# EAGLE design mLRS-rx-board01-v014 (EAGLE 7.5.0)
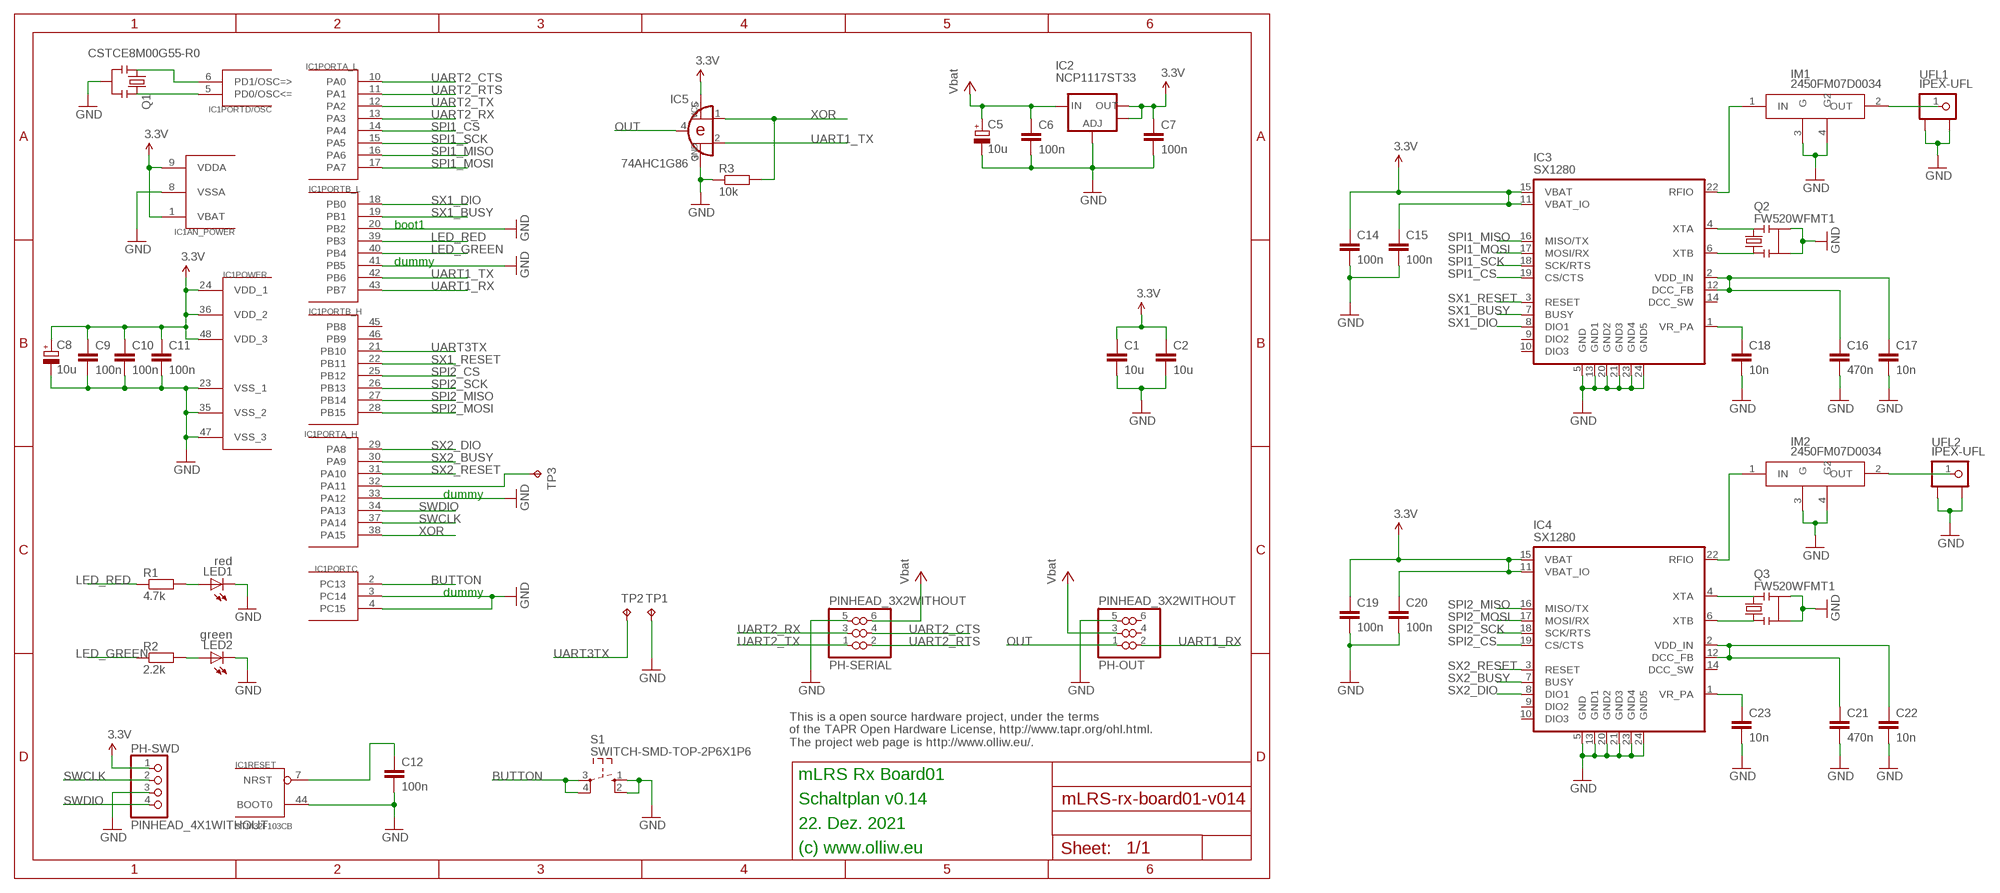
[diagram p0: schematic, sheet 1]

## Parts
C1  10u  C-EUC0603  [C0603]
C2  10u  C-EUC0603  [C0603]
C5  10u  CPOL-EUSMCA  [SMC_A]
C6  100n  C-EUC0603  [C0603]
C7  100n  C-EUC0603  [C0603]
C8  10u  CPOL-EUSMCA  [SMC_A]
C9  100n  C-EUC0603  [C0603]
C10  100n  C-EUC0603  [C0603]
C11  100n  C-EUC0603  [C0603]
C12  100n  C-EUC0603  [C0603]
C14  100n  C-EUC0402  [C0402]
C15  100n  C-EUC0402  [C0402]
C16  470n  C-EUC0402  [C0402]
C17  10n  C-EUC0402  [C0402]
C18  10n  C-EUC0402  [C0402]
C19  100n  C-EUC0402  [C0402]
C20  100n  C-EUC0402  [C0402]
C21  470n  C-EUC0402  [C0402]
C22  10n  C-EUC0402  [C0402]
C23  10n  C-EUC0402  [C0402]
IC1  STM32F103CB  STM32F10XCXT6  [TQFP48]
IC2  NCP1117ST33  V_REG_LM1117SOT223  [SOT223]
IC3  SX1280  [QFN24-4X4-SX128X]
IC4  SX1280  [QFN24-4X4-SX128X]
IC5  74AHC1G86  [SOT23-5-VER1]
IM1  2450FM07D0034  SX-IMPEDANCE-MATCH  [SX-IMPEDANCE-MATCH]
IM2  2450FM07D0034  SX-IMPEDANCE-MATCH  [SX-IMPEDANCE-MATCH]
LED1  red  LEDCHIPLED_0603  [CHIPLED_0603]
LED2  green  LEDCHIPLED_0603  [CHIPLED_0603]
PH-OUT  PINHEAD_3X2WITHOUT  [PINHEAD_3X2_WO]
PH-SERIAL  PINHEAD_3X2WITHOUT  [PINHEAD_3X2_WO]
PH-SWD  PINHEAD_4X1WITHOUT  [PINHEAD_4X1_WO]
Q1  CSTCE8M00G55-R0  RESONATORSMD  [RESONATOR-SMD]
Q2  FW520WFMT1  CRYSTAL52MHZ  [CRYSTAL-SMD-2X1P6-GND]
Q3  FW520WFMT1  CRYSTAL52MHZ  [CRYSTAL-SMD-2X1P6-GND]
R1  4.7k  R-EU_R0402  [R0402]
R2  2.2k  R-EU_R0402  [R0402]
R3  10k  R-EU_R0402  [R0402]
S1  SWITCH-SMD-TOP-2P6X1P6  [TACTILE-SWITCH-SMD-TOP-2P6X1X6]
TP1  TPB1,27  [B1,27]
TP2  TPB1,27  [B1,27]
TP3  TPTP08R  [TP08R]
UFL1  IPEX-UFL  [IPEX-UFL-SMD]
UFL2  IPEX-UFL  [IPEX-UFL-SMD]

## Nets
3.3V: C1.1 C2.1 C7.1 C8.+ C9.1 C10.1 C11.1 C14.1 C15.1 C19.1 C20.1 IC1.1(AN_POWER:VBAT) IC1.9(AN_POWER:VDDA) IC1.24(POWER:VDD_1) IC1.36(POWER:VDD_2) IC1.48(POWER:VDD_3) IC2.2(OUT) IC2.4(OUT) IC3.11(VBAT_IO) IC3.15(VBAT) IC4.11(VBAT_IO) IC4.15(VBAT) IC5.5(VCC) PH-SWD.1
BUTTON: IC1.2(PORTC:PC13) S1.3 S1.4
GND: C1.2 C2.2 C5.- C6.2 C7.2 C8.- C9.2 C10.2 C11.2 C12.2 C14.2 C15.2 C16.2 C17.2 C18.2 C19.2 C20.2 C21.2 C22.2 C23.2 IC1.3(PORTC:PC14) IC1.4(PORTC:PC15) IC1.8(AN_POWER:VSSA) IC1.20(PORTB_L:PB2) IC1.23(POWER:VSS_1) IC1.33(PORTA_H:PA12) IC1.35(POWER:VSS_2) IC1.41(PORTB_L:PB5) IC1.44(RESET:BOOT0) IC1.47(POWER:VSS_3) IC2.1(ADJ) IC3.5(GND) IC3.13(GND1) IC3.20(GND2) IC3.21(GND3) IC3.23(GND4) IC3.24(GND5) IC4.5(GND) IC4.13(GND1) IC4.20(GND2) IC4.21(GND3) IC4.23(GND4) IC4.24(GND5) IC5.3(GND) IM1.3(G) IM1.4(G2) IM2.3(G) IM2.4(G2) LED1.C LED2.C PH-OUT.5 PH-SERIAL.5 PH-SWD.3 Q1.2 Q2.2 Q2.4 Q3.2 Q3.4 R3.1 S1.1 S1.2 TP1.TP UFL1.2 UFL1.3 UFL2.2 UFL2.3
LED_GREEN: IC1.40(PORTB_L:PB4) R2.1
LED_RED: IC1.39(PORTB_L:PB3) R1.1
N$1: IC4.4(XTA) Q3.3
N$2: C21.1 C22.1 IC4.2(VDD_IN) IC4.12(DCC_FB)
N$3: C23.1 IC4.1(VR_PA)
N$4: IC4.6(XTB) Q3.1
N$5: C12.1 IC1.7(RESET:NRST)
N$6: IC4.22(RFIO) IM2.1(IN)
N$7: C16.1 C17.1 IC3.2(VDD_IN) IC3.12(DCC_FB)
N$9: IC1.32(PORTA_H:PA11) TP3.TP
N$10: C18.1 IC3.1(VR_PA)
N$11: IC3.4(XTA) Q2.3
N$12: IC1.5(PORTD/OSC:PD0/OSC<=) Q1.3
N$13: IC3.6(XTB) Q2.1
N$14: IC1.6(PORTD/OSC:PD1/OSC=>) Q1.1
N$15: IC3.22(RFIO) IM1.1(IN)
N$17: LED1.A R1.2
N$18: IM2.2(OUT) UFL2.1
N$19: LED2.A R2.2
OUT: IC5.4(O) PH-OUT.1
SPI1_CS: IC1.14(PORTA_L:PA4) IC3.19(CS/CTS)
SPI1_MISO: IC1.16(PORTA_L:PA6) IC3.16(MISO/TX)
SPI1_MOSI: IC1.17(PORTA_L:PA7) IC3.17(MOSI/RX)
SPI1_SCK: IC1.15(PORTA_L:PA5) IC3.18(SCK/RTS)
SPI2_CS: IC1.25(PORTB_H:PB12) IC4.19(CS/CTS)
SPI2_MISO: IC1.27(PORTB_H:PB14) IC4.16(MISO/TX)
SPI2_MOSI: IC1.28(PORTB_H:PB15) IC4.17(MOSI/RX)
SPI2_SCK: IC1.26(PORTB_H:PB13) IC4.18(SCK/RTS)
SWCLK: IC1.37(PORTA_H:PA14) PH-SWD.2
SWDIO: IC1.34(PORTA_H:PA13) PH-SWD.4
SX1_BUSY: IC1.19(PORTB_L:PB1) IC3.7(BUSY)
SX1_DIO: IC1.18(PORTB_L:PB0) IC3.8(DIO1)
SX1_RESET: IC1.22(PORTB_H:PB11) IC3.3(RESET)
SX2_BUSY: IC1.30(PORTA_H:PA9) IC4.7(BUSY)
SX2_DIO: IC1.29(PORTA_H:PA8) IC4.8(DIO1)
SX2_RESET: IC1.31(PORTA_H:PA10) IC4.3(RESET)
UART1_RX: IC1.43(PORTB_L:PB7) PH-OUT.2
UART1_TX: IC1.42(PORTB_L:PB6) IC5.2(I1)
UART2_CTS: IC1.10(PORTA_L:PA0) PH-SERIAL.4
UART2_RTS: IC1.11(PORTA_L:PA1) PH-SERIAL.2
UART2_RX: IC1.13(PORTA_L:PA3) PH-SERIAL.3
UART2_TX: IC1.12(PORTA_L:PA2) PH-SERIAL.1
UART3TX: IC1.21(PORTB_H:PB10) TP2.TP
UFL1: IM1.2(OUT) UFL1.1
VCC: C5.+ C6.1 IC2.3(IN) PH-OUT.3 PH-SERIAL.6 ; supply symbol labelled Vbat
XOR: IC1.38(PORTA_H:PA15) IC5.1(I0) R3.2
Unconnected: IC1.45(PORTB_H:PB8) IC1.46(PORTB_H:PB9) IC3.9(DIO2) IC3.10(DIO3) IC3.14(DCC_SW) IC4.9(DIO2) IC4.10(DIO3) IC4.14(DCC_SW) PH-OUT.4 PH-OUT.6

## Notes on the sheet
- boot1
- dummy
- dummy
- dummy
- This is a open source hardware project, under the terms
  of the TAPR Open Hardware License, http://www.tapr.org/ohl.html.
  The project web page is http://www.olliw.eu/.
- mLRS Rx Board01
- Schaltplan v0.14
- 22. Dez. 2021
- (c) www.olliw.eu

## Library data of the parts
C1 C2 C6 C7 C9-C12 C14-C23 = rcl:C-EU: CAPACITOR, European symbol
C5 C8 = rcl:CPOL-EU: POLARIZED CAPACITOR, European symbol
IC1 = # stm32:STM32F10XCXT6: ST STM32F101/103 48pin LQFP
IC2 = # SparkFun2:V_REG_LM1117: Voltage Regulator LM1117 Standard adjustable voltage regulator but in SMD form. Spark Fun Electronics SKU : COM-00595
IC3 IC4 = # stdlib:SX1280
IC5 = # stdlib:74AHC1G86
IM1 IM2 = # stdlib:SX-IMPEDANCE-MATCH
LED1 LED2 = led:LED: LED OSRAM: - CHIPLED LG R971, LG N971, LY N971, LG Q971, LY Q971, LO R971, LY R971 LH N974, LH R974 LS Q976, LO Q976, LY Q976 LO Q996 - Hyper CHIPLED LW Q18S LB Q993, LB Q99A, LB R99A - SideLED LS A670, LO A670, LY A670, LG A670, LP A670 LB A673, LV A673, LT A673, LW A673 LH A674 LY A675 LS A676, LA A676, LO A676, LY A676, LW A676 LS A679, LY A679, LG A679 - Hyper Micro SIDELED® LS Y876, LA Y876, LO Y876, LY Y876 LT Y87S - SmartLED LW L88C, LW L88S LB L89C, LB L89S, LG L890 LS L89K, LO L89K, LY L89K LS L896, LA L896, LO L896, LY L896 - TOPLED LS T670, LO T670, LY T670, LG T670, LP T670 LSG T670, LSP T670, LSY T670, LOP T670, LYG T670 LG T671, LOG T671, LSG T671 LB T673, LV T673, LT T673, LW T673 LH T674 LS T676, LA T676, LO T676, LY T676, LB T676, LH T676, LSB T676, LW T676 LB T67C, LV T67C, LT T67C, LS T67K, LO T67K, LY T67K, LW E67C LS E67B, LA E67B, LO E67B, LY E67B, LB E67C, LV E67C, LT E67C LW T67C LS T679, LY T679, LG T679 LS T770, LO T770, LY T770, LG T770, LP T770 LB T773, LV T773, LT T773, LW T773 LH T774 LS E675, LA E675, LY E675, LS T675 LS T776, LA T776, LO T776, LY T776, LB T776 LHGB T686 LT T68C, LB T68C - Hyper Mini TOPLED® LB M676 - Mini TOPLED Santana® LG M470 LS M47K, LO M47K, LY M47K Source: http://www.osram.convergy.de LUXEON: - LUMILED® LXK2-PW12-R00, LXK2-PW12-S00, LXK2-PW14-U00, LXK2-PW14-V00 LXK2-PM12-R00, LXK2-PM12-S00, LXK2-PM14-U00 LXK2-PE12-Q00, LXK2-PE12-R00, LXK2-PE12-S00, LXK2-PE14-T00, LXK2-PE14-U00 LXK2-PB12-K00, LXK2-PB12-L00, LXK2-PB12-M00, LXK2-PB14-N00, LXK2-PB14-P00, LXK2-PB14-Q00 LXK2-PR12-L00, LXK2-PR12-M00, LXK2-PR14-Q00, LXK2-PR14-R00 LXK2-PD12-Q00, LXK2-PD12-R00, LXK2-PD12-S00 LXK2-PH12-R00, LXK2-PH12-S00 LXK2-PL12-P00, LXK2-PL12-Q00, LXK2-PL12-R00 Source: www.luxeon.com KINGBRIGHT: KA-3528ASYC Source: www.kingbright.com
PH-OUT PH-SERIAL = # stdlib:PINHEAD_3X2
PH-SWD = # stdlib:PINHEAD_4X1
Q1 = # SparkFun2:RESONATOR: Resonator Small SMD resonator. This is the itty bitty 10/20MHz resonators with built in caps. CSTCE10M0G55 and CSTCE20M0V53. Footprint has been reviewed closely but hasn't been tested yet.
Q2 Q3 = # stdlib:CRYSTAL52MHZ
R1-R3 = rcl:R-EU_: RESISTOR, European symbol
S1 = # stdlib:SWITCH-SMD-TOP-2P6X1P6
TP1-TP3 = testpad:TP: Test pad
UFL1 UFL2 = # stdlib:IPEX-UFL

## Board
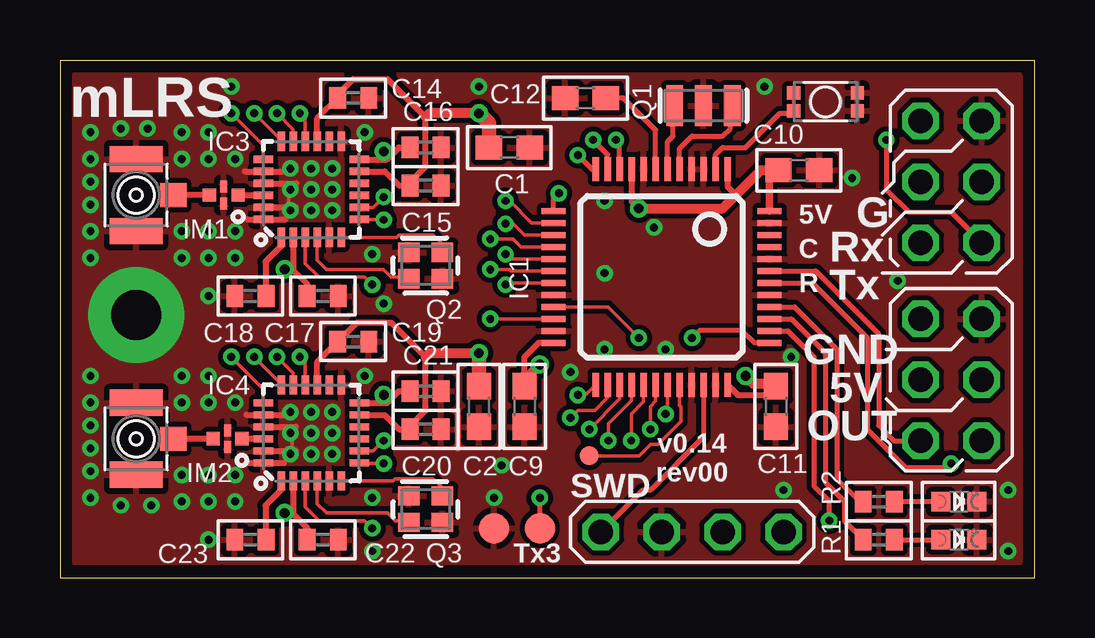
[diagram p1: board, top side]
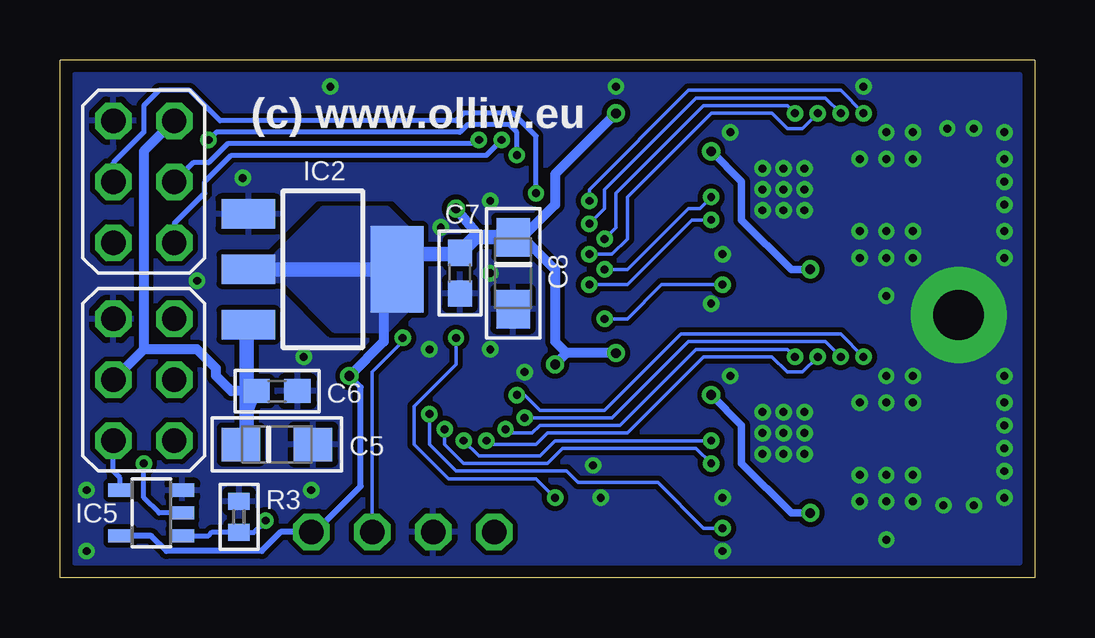
[diagram p2: board, bottom side, seen from below]

Size 40.64 x 21.59 mm. Coordinates in mm from the lower left corner, seen from the top.
Outline: 40.64,0 40.64,21.59 0,21.59 0,0 40.64,0
Copper layers (1*16): Top 0.0356mm / dielectric 1.5011mm / Bottom 0.0356mm
Design rules "ow-oshpark-2layer": minimum track width 6mil, minimum drill 13mil, track to track 6mil, track to pad 6mil, pad to pad 6mil, via to via 6mil, smd to smd 6mil, copper to edge 15mil, drill to drill 6mil, minimum pad ring 7mil, minimum via ring 7mil, stop-mask expansion 2.5mil, vias tented up to drill 26mil, thermal gap 10mil

### Footprints (pad centres in the part's own frame; a part is rotated, then mirrored left to right if it is on the bottom)
C0603 = smd 1.1 x 1: 1 -0.85,0; 2 0.85,0
SMC_A = smd 1.6 x 1.4: + -1.5,0; - 1.5,0
C0402 = smd 0.7 x 0.9: 1 -0.65,0; 2 0.65,0
TQFP48 = smd 0.254 x 1: 1 -2.75,-4.5; 2 -2.25,-4.5; 3 -1.75,-4.5; 4 -1.25,-4.5; 5 -0.75,-4.5; 6 -0.25,-4.5; 7 0.25,-4.5; 8 0.75,-4.5; 9 1.25,-4.5; 10 1.75,-4.5; 11 2.25,-4.5; 12 2.75,-4.5; 25 2.75,4.5; 26 2.25,4.5; 27 1.75,4.5; 28 1.25,4.5; 29 0.75,4.5; 30 0.25,4.5; 31 -0.25,4.5; 32 -0.75,4.5; 33 -1.25,4.5; 34 -1.75,4.5; 35 -2.25,4.5; 36 -2.75,4.5 | smd 1 x 0.254: 13 4.5,-2.75; 14 4.5,-2.25; 15 4.5,-1.75; 16 4.5,-1.25; 17 4.5,-0.75; 18 4.5,-0.25; 19 4.5,0.25; 20 4.5,0.75; 21 4.5,1.25; 22 4.5,1.75; 23 4.5,2.25; 24 4.5,2.75; 37 -4.5,2.75; 38 -4.5,2.25; 39 -4.5,1.75; 40 -4.5,1.25; 41 -4.5,0.75; 42 -4.5,0.25; 43 -4.5,-0.25; 44 -4.5,-0.75; 45 -4.5,-1.25; 46 -4.5,-1.75; 47 -4.5,-2.25; 48 -4.5,-2.75
SOT223 = smd 1.219 x 2.235: 1 -2.311,-3.099; 2 0,-3.099; 3 2.311,-3.099 | smd 3.6 x 2.2: 4 0,3.099
QFN24-4X4-SX128X = smd 0.8 x 0.3: 1 -2,1.25; 2 -2,0.75; 3 -2,0.25; 4 -2,-0.25; 5 -2,-0.75; 6 -2,-1.25; 13 2,-1.25; 14 2,-0.75; 15 2,-0.25; 16 2,0.25; 17 2,0.75; 18 2,1.25 | smd 0.3 x 0.8: 7 -1.25,-2; 8 -0.75,-2; 9 -0.25,-2; 10 0.25,-2; 11 0.75,-2; 12 1.25,-2; 19 1.25,2; 20 0.75,2; 21 0.25,2; 22 -0.25,2; 23 -0.75,2; 24 -1.25,2
SOT23-5-VER1 = smd 0.55 x 0.99: 1 -0.95,-1.29; 2 0,-1.29; 3 0.95,-1.29; 4 0.95,1.3; 5 -0.95,1.3
SX-IMPEDANCE-MATCH = smd 0.55 x 0.55: 1 -0.6,0; 2 0.6,0 | smd 0.3 x 0.5: 3 0,-0.35; 4 0,0.35
CHIPLED_0603 = smd 0.8 x 0.8: A 0,-0.75; C 0,0.75
PINHEAD_3X2_WO = drill 1.016 octagon: 1 0,0; 2 2.54,0; 3 0,-2.54; 4 2.54,-2.54; 5 0,-5.08; 6 2.54,-5.08
PINHEAD_4X1_WO = drill 1.016 octagon: 1 0,0; 2 0,-2.54; 3 0,-5.08; 4 0,-7.62
RESONATOR-SMD = smd 0.7 x 1.7: 1 -1.2,0; 2 0,0; 3 1.2,0
CRYSTAL-SMD-2X1P6-GND = smd 0.9 x 0.8: 1 -0.7,-0.55; 2 0.7,-0.55; 3 0.7,0.55; 4 -0.7,0.55
R0402 = smd 0.7 x 0.9: 1 -0.65,0; 2 0.65,0
TACTILE-SWITCH-SMD-TOP-2P6X1X6 = smd 0.55 x 0.55: 1 -1.325,0.375; 2 -1.325,-0.375; 3 1.325,-0.375; 4 1.325,0.375
B1,27 = smd 1.27 x 1.27: TP 0,0
TP08R = smd 0.8 x 0.8: TP 0,0
IPEX-UFL-SMD = smd 1 x 1.1: 1 0,-1.55 | smd 1.1 x 2.2: 2 -1.5,0; 3 1.5,0

### Placement (x,y rotation side)
C1  18.73,17.94 0 top
C2  17.46,7.14 270 top
C5  31.59,5.56 0 bottom
C6  31.59,7.78 0 bottom
C7  23.97,12.7 270 bottom
C8  21.75,12.7 270 bottom
C9  19.37,7.14 270 top
C10  30.8,16.99 0 top
C11  29.85,7.14 270 top
C12  21.91,20 180 top
C14  12.22,20 0 top
C15  15.24,16.35 0 top
C16  15.24,17.94 0 top
C17  10.95,11.75 0 top
C18  7.94,11.75 180 top
C19  12.22,9.84 0 top
C20  15.24,6.19 0 top
C21  15.24,7.78 0 top
C22  10.95,1.59 0 top
C23  7.94,1.59 180 top
IC1  25.08,12.54 180 top
IC2  29.69,12.86 270 bottom
IC3  10.48,16.19 90 top
IC4  10.48,6.03 90 top
IC5  36.83,2.7 90 bottom
IM1  6.83,15.95 180 top
IM2  6.98,5.79 180 top
LED1  37.46,1.59 270 top
LED2  37.46,3.18 270 top
PH-OUT  38.42,5.71 180 top
PH-SERIAL  38.42,13.97 180 top
PH-SWD  30.16,1.9 270 top
Q1  26.83,19.69 0 top
Q2  15.24,13.02 180 top
Q3  15.24,2.86 180 top
R1  34.13,1.59 0 top
R2  34.13,3.18 0 top
R3  33.18,2.54 270 bottom
S1  31.91,19.84 180 top
TP1  18.1,2.06 0 top
TP2  20,2.06 0 top
TP3  22.07,5.08 0 top
UFL1  3.18,15.95 90 top
UFL2  3.18,5.79 90 top

### Tracks (layer width: path | path; a pad name or v marks a point on that pad's centre or on a via)
3.3V  (via drill 0.4)
  Top 0.254: IC4.15 10.73,9 C19.1 | IC1.36 28.26,7.62 29.58,7.62 | IC1.24 19.95,9.79 19.37,9.21 C9.1 | IC1.9 23.83,15.7 v24.13,15.4 | IC1.1 27.83,16.3 28.18,15.95 | IC4.11 13.54,6.78 14.13,6.19 C20.1 14.59,6.33 15.24,6.98 15.24,9.21 13.81,10.64 12.38,10.64 11.57,9.83 C19.1 | C19.1 11.59,9.84 | IC3.11 13.54,16.94 14.13,16.35 14.45,16.35 | 14.45,16.35 C15.1 | 14.45,16.35 15.24,17.14 15.24,19.21 13.65,20.8 12.22,20.8 11.59,20.16 11.59,19.86 C14.1 10.73,19.16 IC3.15
  Top 0.305: 29.58,7.62 C11.1 29.58,8.1 | IC1.48 29.58,16.94 C10.1 | 19.21,8.1 19.31,8.1 C9.1
  Top 0.406: v24.13,15.4 27.62,15.4 28.18,15.95 29.21,16.99 C10.1 | v28.57,8.41 28.89,8.1 29.58,8.1 | v20,8.89 19.21,8.1 | v17.46,19.37 15.4,19.37 15.24,19.21 | 15.24,9.21 15.4,9.37 v17.46,9.37
  Top 0.61: C1.1 17.88,18.95 v17.46,19.37 | C2.1 v17.46,9.37
  Bottom 0.203: 37.97,1.75 IC5.5
  Bottom 0.254: v28.57,8.41 28.1,7.94 28.1,3.81 30,1.9 PH-SWD.1 31.43,1.9 32.23,1.11 36.2,1.11 36.83,1.75 37.97,1.75 | 21.66,14.2 21.59,14.13 21.27,14.13 | 21.11,14.45 21.5,14.45 C8.+
  Bottom 0.305: IC2.4 27.06,11.67 27.15,11.59
  Bottom 0.406: IC2.4 27.06,13.1 26.67,13.49 | 24.19,13.49 C7.1 | 21.66,14.2 C8.+ | 23.32,14.2 23.32,14.43 v24.13,15.4 | 27.15,11.59 27.15,9.84 v28.57,8.41 | 21.27,14.13 20,12.86 20,9.84 19.53,9.37 | 21.11,14.45 20,15.56 20,16.83 v17.46,19.37 | v17.46,9.37 19.53,9.37 | 19.53,9.37 v20,8.89
  Bottom 0.61: IC2.2 IC2.4 | C8.+ 23.32,14.2 C7.1 | 26.67,13.49 24.19,13.49
  pour Bottom (no thermals): 26.19,11.11 26.19,14.6 26.99,15.4 29.69,15.4 31.75,13.33 31.75,12.38 31.27,12.38 29.21,10.32 26.99,10.32
BUTTON
  Top 0.152: S1.3 S1.4
  Top 0.203: IC1.2 27.33,17.65 27.62,17.94 28.57,17.94 30,19.37 30.48,19.37 S1.4
GND  (via drill 0.33, 2.1 pad 4)
  Top 0.152: IC3.23 9.48,15.44 | 9.48,15.44 9.53,15.4 | IC3.21 9.43,16.44 9.53,16.35 9.53,15.49 9.48,15.44 | IC4.21 9.59,6.28 9.68,6.19 9.68,5.56
  Top 0.254: 7.78,6.79 9.37,6.79 | 8.25,6.29 9.84,6.29 | 8.24,5.29 9.82,5.29 | 7.74,4.78 9.33,4.78 | 7.82,14.94 9.4,14.94 | 8.25,15.45 9.84,15.45 | 8.26,16.44 9.85,16.44 | 7.7,16.94 9.29,16.94 | 16.59,5.39 16.59,6.98
  other vias: 3.18,10.95 11.35,5.16 9.6,6.03 9.6,6.91 9.6,5.16 10.48,6.91 11.35,6.91 13.02,3.33 9.6,16.19 9.6,17.07 10.48,17.07 11.35,17.07 9.6,15.32 11.35,15.32 13.02,13.49 11.35,6.03 10.48,6.03 10.48,5.16 11.35,16.19 10.48,16.19 10.48,15.32 25.24,9.53 22.7,15.72 21.27,8.57 24.77,14.6 22.7,12.7 22.7,9.53 30.16,3.65 18.1,3.33 18.42,4.68 13.02,1.11 13.49,11.43 17.46,20.48 7.14,20.48 29.37,20.48 33.02,16.67 30.48,9.21 1.27,14.45 1.27,15.56 1.27,17.46 5.08,17.46 5.08,14.45 6.19,14.45 6.19,17.46 7.3,17.46 7.3,14.45 7.3,13.33 6.19,13.33 5.08,13.33 1.27,13.33 5.08,18.57 6.19,18.57 1.27,18.57 1.27,16.51 5.08,7.3 6.19,7.3 7.3,7.3 6.19,8.41 5.08,8.41 1.27,8.41 1.27,7.3 1.27,4.45 1.27,3.33 1.27,5.4 1.27,6.35 5.08,4.29 6.19,4.29 7.3,4.29 7.3,3.18 6.19,3.18 5.08,3.18 6.19,11.75 6.19,1.59 2.54,18.73 3.65,18.73 2.54,3.02 3.81,3.02 12.7,8.41 12.7,18.57 39.53,1.11 34.92,12.38 39.53,3.65
  pour Bottom (isolate 0.203, rank 6): 0.64,20.96 40,20.96 40,0.64 0.64,0.64
  pour Top (isolate 0.203, rank 6): 0.64,20.96 40,20.96 40,0.64 0.64,0.64
LED_GREEN
  Top 0.203: IC1.40 30.62,11.29 32.38,9.53 32.38,4.11 33.34,3.18 R2.1
LED_RED
  Top 0.203: IC1.39 30.48,10.79 31.91,9.37 31.91,3.97 32.7,3.18 32.7,2.37 R1.1
N$1
  Top 0.152: IC4.4 10.73,3.08 11.11,2.7 13.65,2.7 13.97,2.38 14.47,2.38 Q3.3
N$2  (via drill 0.4)
  Top 0.254: C21.1 14.13,7.78 13.63,7.28 13.49,7.28 | IC4.2 9.73,2.7 | 9.73,2.7 9.73,2.65 10.32,2.06 10.32,1.6 C22.1 | v9.37,2.7 9.73,2.7 | IC4.12 13.49,7.28 | v13.49,7.62 13.49,7.28
  Bottom 0.305: v13.49,7.62 12.22,6.35 12.22,4.76 10.16,2.7 v9.37,2.7
N$3
  Top 0.254: IC4.1 9.23,3.67 8.57,3.02 8.57,1.57
  Top 0.305: 8.57,1.57 C23.1
N$4
  Top 0.152: IC4.6 13.87,4.03 13.97,4.13 15.56,4.13 15.87,3.81 15.87,3.31 Q3.1
N$5
  Top 0.203: IC1.7 24.83,18.67 23.5,20 C12.1
N$6
  Top 0.152: 7.65,5.78 IM2.1
  Top 0.254: IC4.22 7.65,5.78
N$7  (via drill 0.4)
  Top 0.152: 10.32,11.6 C17.1
  Top 0.254: IC3.2 9.73,12.81 | 9.73,12.81 10.32,12.22 10.32,11.76 C17.1 | 9.68,12.86 9.73,12.81 | IC3.12 13.33,17.44 | 13.33,17.44 13.63,17.44 14.13,17.94 C16.1 | v13.49,17.78 13.49,17.6 13.33,17.44
  Top 0.305: v9.37,12.86 9.68,12.86
  Bottom 0.305: v13.49,17.78 12.22,16.51 12.22,14.92 10.16,12.86 v9.37,12.86
N$9
  Top 0.152: IC1.32 25.83,7.19 25.88,7.14 25.88,6.51 24.92,5.56 24.61,5.56 24.13,5.08 TP3.TP
N$10
  Top 0.254: IC3.1 9.23,13.83 8.57,13.18 8.57,11.76 C18.1
N$11
  Top 0.152: IC3.4 10.73,13.24 11.11,12.86 13.49,12.86 13.81,12.54 14.47,12.54 Q2.3
N$12
  Top 0.203: IC1.5 25.83,17.89 26.35,18.42 27.62,18.42 27.94,18.73 27.94,19.6 Q1.3
N$13
  Top 0.152: IC3.6 14.03,14.19 14.13,14.29 15.56,14.29 15.87,13.97 15.87,13.47 Q2.1
N$14
  Top 0.203: IC1.6 25.33,18.19 25.56,18.42 25.56,19.62 Q1.1
N$15
  Top 0.152: 7.49,15.94 IM1.1
  Top 0.254: IC3.22 7.49,15.94
N$17
  Top 0.203: R1.2 LED1.A
N$18
  Top 0.254: IM2.2 UFL2.1
N$19
  Top 0.203: R2.2 LED2.A
OUT
  Bottom 0.203: IC5.4 38.13,4.16 38.42,4.45 PH-OUT.1
SPI1_CS  (via drill 0.33)
  Top 0.152: IC1.14 19.66,14.79 18.73,15.72 v18.57,15.72 | IC3.19 8.48,18.03 v7.14,19.37
  Bottom 0.152: v7.14,19.37 8.1,20.32 14.45,20.32 18.57,16.19 v18.57,15.72
SPI1_MISO  (via drill 0.33)
  Top 0.152: IC1.16 19.23,13.79 18.89,14.13 v17.94,14.13 | IC3.16 10.23,19.14 v10,19.37
  Bottom 0.152: v10,19.37 10.32,19.69 13.81,19.69 17.46,16.03 17.46,14.6 v17.94,14.13
SPI1_MOSI  (via drill 0.33)
  Top 0.152: IC1.17 18.78,13.29 v18.57,13.49 | IC3.17 9.73,18.69 v9.05,19.37
  Bottom 0.152: v9.05,19.37 9.68,18.73 10.32,18.73 10.95,19.37 13.49,19.37 16.99,15.87 16.99,14.13 17.62,13.49 v18.57,13.49
SPI1_SCK  (via drill 0.33)
  Top 0.152: IC1.15 19.36,14.29 18.89,14.76 v18.57,14.76 | IC3.18 9.23,18.24 v8.1,19.37
  Bottom 0.152: v8.1,19.37 8.73,20 14.13,20 17.94,16.19 17.94,15.4 v18.57,14.76
SPI2_CS  (via drill 0.33)
  Top 0.152: IC4.19 8.48,7.87 v7.14,9.21 | v21.59,7.62 21.91,7.62 IC1.25
  Bottom 0.152: v7.14,9.21 8.1,10.16 14.76,10.16 17.94,6.98 20.64,6.98 21.27,7.62 v21.59,7.62
SPI2_MISO  (via drill 0.33)
  Top 0.152: IC4.16 10.23,8.98 v10,9.21 | IC1.27 23.33,7.46 v22.07,6.19
  Bottom 0.152: v10,9.21 10.32,9.53 14.13,9.53 17.3,6.35 20.64,6.35 20.96,6.03 21.91,6.03 v22.07,6.19
SPI2_MOSI  (via drill 0.33)
  Top 0.152: IC1.28 23.83,7.4 22.86,6.43 v22.86,5.71 | IC4.17 9.73,8.53 v9.05,9.21
  Bottom 0.152: v9.05,9.21 9.68,8.57 10.32,8.57 10.95,9.21 13.81,9.21 16.99,6.03 20.32,6.03 20.8,5.56 22.7,5.56 v22.86,5.71
SPI2_SCK  (via drill 0.33)
  Top 0.152: IC1.26 22.83,7.51 22.3,6.98 21.59,6.98 v21.27,6.67 | IC4.18 9.23,8.08 v8.1,9.21
  Bottom 0.152: v8.1,9.21 8.73,9.84 14.45,9.84 17.62,6.67 v21.27,6.67
SWCLK  (via drill 0.33)
  Top 0.203: IC1.37 28.94,9.79 28.42,10.32 26.67,10.32 v26.35,10
  Bottom 0.152: v26.35,10 26.35,9.84 27.62,8.57 PH-SWD.2
SWDIO
  Top 0.203: IC1.34 26.83,5.88 24.61,3.65 24.29,3.65 PH-SWD.4
SX1_BUSY  (via drill 0.33)
  Top 0.152: IC1.19 18.64,12.29 v18.57,12.22 | IC3.7 13.47,14.94 v13.49,14.92
  Bottom 0.152: v13.49,14.92 14.29,14.92 16.99,12.22 v18.57,12.22
SX1_DIO  (via drill 0.33)
  Top 0.152: IC3.8 13.06,15.44 v13.49,15.87 | IC1.18 18.8,12.79 18.73,12.86 v17.94,12.86
  Bottom 0.152: v17.94,12.86 16.99,12.86 14.45,15.4 13.97,15.4 v13.49,15.87
SX1_RESET  (via drill 0.33)
  Top 0.152: v17.94,10.79 18.1,10.79 IC1.22 | IC3.3 10.23,13.11 10.79,12.54 12.7,12.54 v13.02,12.22
  Bottom 0.152: v13.02,12.22 15.56,12.22 16.99,10.79 v17.94,10.79
SX2_BUSY  (via drill 0.33)
  Top 0.152: IC4.7 12.56,4.78 12.54,4.76 v13.49,4.76 | IC1.30 24.83,7.37 24.61,7.14 v24.61,6.19
  Bottom 0.152: v13.49,4.76 14.13,5.4 19.69,5.4 20.32,4.76 23.81,4.76 24.61,5.56 v24.61,6.19
SX2_DIO  (via drill 0.33)
  Top 0.152: IC1.29 24.33,7.35 23.81,6.83 v23.81,5.71 | IC4.8 13.06,5.28 v13.49,5.71
  Bottom 0.152: v13.49,5.71 20,5.71 20.64,5.08 23.18,5.08 v23.81,5.71
SX2_RESET  (via drill 0.33)
  Top 0.152: IC1.31 25.33,6.89 v25.24,6.83 | IC4.3 10.23,2.95 10.79,2.38 12.7,2.38 v13.02,2.06
  Bottom 0.152: v25.24,6.83 25.24,5.56 24.13,4.45 19.53,4.45 19.05,3.97 15.72,3.97 13.81,2.06 v13.02,2.06
UART1_RX
  Top 0.203: IC1.43 31.5,12.79 34.13,10.16 34.13,6.35 34.77,5.71 PH-OUT.2
UART1_TX  (via drill 0.33)
  Top 0.203: IC1.42 31.36,12.29 33.66,10 33.66,6.19 35.24,4.6 36.99,4.6 v37.15,4.76
  Bottom 0.203: IC5.2 36.51,2.7 37.15,3.33 v37.15,4.76
UART2_CTS  (via drill 0.33)
  Top 0.203: IC1.10 23.33,18.1 v23.18,18.26
  Bottom 0.203: v23.18,18.26 23.34,18.1 33.66,18.1 34.45,17.3 35.08,17.3 PH-SERIAL.4
UART2_RTS  (via drill 0.33)
  Top 0.203: IC1.11 22.83,17.65 v22.23,18.26
  Bottom 0.203: v22.23,18.26 22.86,17.62 33.5,17.62 34.61,16.51 34.61,16.03 35.88,14.76 PH-SERIAL.2
UART2_RX  (via drill 0.33)
  Top 0.203: IC1.13 20.58,15.82 v20.8,16.03
  Bottom 0.203: v20.8,16.03 20.8,18.42 21.75,19.37 23.81,19.37 24.13,19.05 33.97,19.05 35.24,20.32 36.51,20.32 37.15,19.69 37.15,18.57 38.42,17.3 PH-SERIAL.3
UART2_TX  (via drill 0.33)
  Top 0.152: IC1.12
  Top 0.203: v34.45,18.26 34.45,16.19 35.4,15.24 37.15,15.24 PH-SERIAL.1 | IC1.12 22.17,17.04 v21.59,17.62
  Bottom 0.203: v21.59,17.62 21.59,18.57 21.91,18.89 23.65,18.89 23.97,18.57 34.13,18.57 v34.45,18.26
UART3TX  (via drill 0.33)
  Top 0.152: IC1.21 22.84,11.29 v24.13,10
  Top 0.203: TP2.TP v20,3.33
  Bottom 0.152: v24.13,10 24.13,8.89 25.88,7.14 25.88,5.56 24.45,4.13 20.8,4.13 20.16,3.49
  Bottom 0.203: v20,3.33 20.16,3.49
UFL1
  Top 0.254: IM1.2 UFL1.1
VCC
  Bottom 0.406: 37.15,9.53 37.15,17.78 PH-SERIAL.6 | 33.26,5.09 C5.+ | C6.1 32.76,6.98 32.76,7.36 32.86,7.78 33.5,7.78 34.13,8.41 34.13,8.73 34.92,9.53 37.15,9.53 | 37.15,9.53 PH-OUT.3
  Bottom 0.61: C5.+ 32.86,5.4 32.86,7.3 | 32.86,7.3 32.86,7.78 32.86,10.47 IC2.3 | C6.1 32.86,7.3
XOR  (via drill 0.33)
  Top 0.203: IC1.38 30.35,10.29 31.43,9.21 31.43,3.81 32.07,3.18 v32.07,2.38
  Bottom 0.203: v32.07,2.38 32.56,1.89 R3.2 33.19,1.9 34.29,1.9 34.45,1.75 IC5.1

### Text on the board
tNames: mLRS | 5V | G | C | Rx | R | Tx | GND | 5V | v0.14 / rev00 | OUT | SWD | Tx3
bNames: (c) www.olliw.eu